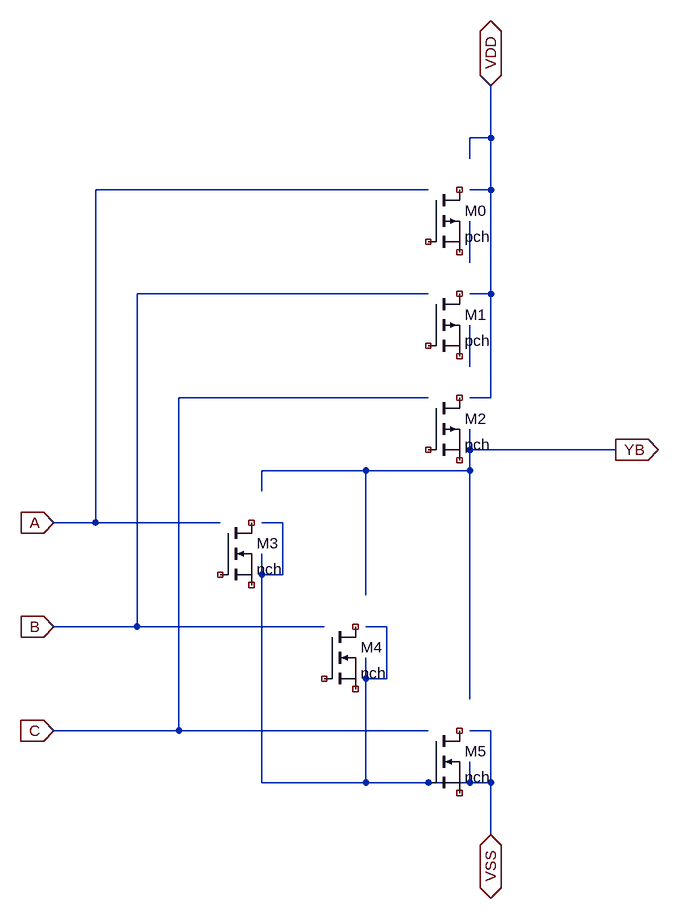
[diagram p0: schematic nr31.asc]
nr31.asc, the LTspice schematic file:
Version 4
SHEET 1 1040 1344
WIRE 224 928 224 416
WIRE 224 928 512 928
WIRE 224 416 672 416
WIRE 96 928 224 928
WIRE 160 256 672 256
WIRE 160 768 160 256
WIRE 160 768 352 768
WIRE 96 768 160 768
WIRE 736 528 736 464
WIRE 736 656 960 656
WIRE 736 656 736 624
WIRE 736 688 736 656
WIRE 576 880 576 688
WIRE 576 688 736 688
WIRE 736 1040 736 688
WIRE 416 688 576 688
WIRE 416 720 416 688
WIRE 736 368 736 304
WIRE 768 1248 768 1168
WIRE 576 1168 576 1008
WIRE 576 1168 736 1168
WIRE 416 1168 576 1168
WIRE 416 1168 416 848
WIRE 416 768 448 768
WIRE 448 848 448 768
WIRE 416 848 448 848
WIRE 736 1168 736 1136
WIRE 736 1168 768 1168
WIRE 416 848 416 816
WIRE 768 1168 768 1088
WIRE 736 1088 768 1088
WIRE 576 1008 576 976
WIRE 576 1008 608 1008
WIRE 608 1008 608 928
WIRE 576 928 608 928
WIRE 768 176 768 96
WIRE 736 416 768 416
WIRE 768 416 768 256
WIRE 736 256 768 256
WIRE 768 256 768 176
WIRE 736 208 736 176
WIRE 736 176 768 176
WIRE 768 576 768 416
WIRE 736 576 768 576
WIRE 288 576 672 576
WIRE 288 1088 288 576
WIRE 288 1088 672 1088
WIRE 96 1088 288 1088
SYMBOL NMOS 672 1088 R0
SYMATTR InstName M5
SYMATTR Value nch
SYMATTR Value2 w=2u l=1u
SYMBOL NMOS 512 928 R0
SYMATTR InstName M4
SYMATTR Value nch
SYMATTR Value2 w=2u l=1u
SYMBOL NMOS 352 768 R0
SYMATTR InstName M3
SYMATTR Value nch
SYMATTR Value2 w=2u l=1u
SYMBOL PMOS 672 576 R0
SYMATTR InstName M2
SYMATTR Value pch
SYMATTR Value2 w=12.6u l=1u
SYMBOL PMOS 672 416 R0
SYMATTR InstName M1
SYMATTR Value pch
SYMATTR Value2 w=12.6u l=1u
SYMBOL PMOS 672 256 R0
SYMATTR InstName M0
SYMATTR Value pch
SYMATTR Value2 w=12.6u l=1u
FLAG 960 656 YB
IOPIN 960 656 Out
FLAG 768 1248 VSS
IOPIN 768 1248 BiDir
FLAG 768 96 VDD
IOPIN 768 96 BiDir
FLAG 96 1088 C
IOPIN 96 1088 In
FLAG 96 928 B
IOPIN 96 928 In
FLAG 96 768 A
IOPIN 96 768 In

The netlist it stands for:
* nr31.asc
* M5: nch w=2u l=1u (symbol NMOS not certain, pin order unknown); nets seen at it: VSS
* M4: nch w=2u l=1u (symbol NMOS not certain, pin order unknown); nets seen at it: 
* M3: nch w=2u l=1u (symbol NMOS not certain, pin order unknown); nets seen at it: 
* M2: pch w=12.6u l=1u (symbol PMOS not certain, pin order unknown); nets seen at it: 
* M1: pch w=12.6u l=1u (symbol PMOS not certain, pin order unknown); nets seen at it: 
* M0: pch w=12.6u l=1u (symbol PMOS not certain, pin order unknown); nets seen at it: 
.backanno
.end